# EasyEDA schematic Jafar Tester-Programmer - EasyEDA - Schematic Export.json
TITLE: Jafar Chip - Programmer/Tester; REV: 5.0; Date: 10-05-2024; Sheet: 1/1; Drawn By: Tony Kuberka; Company: TK's Custom Super Modz LLC
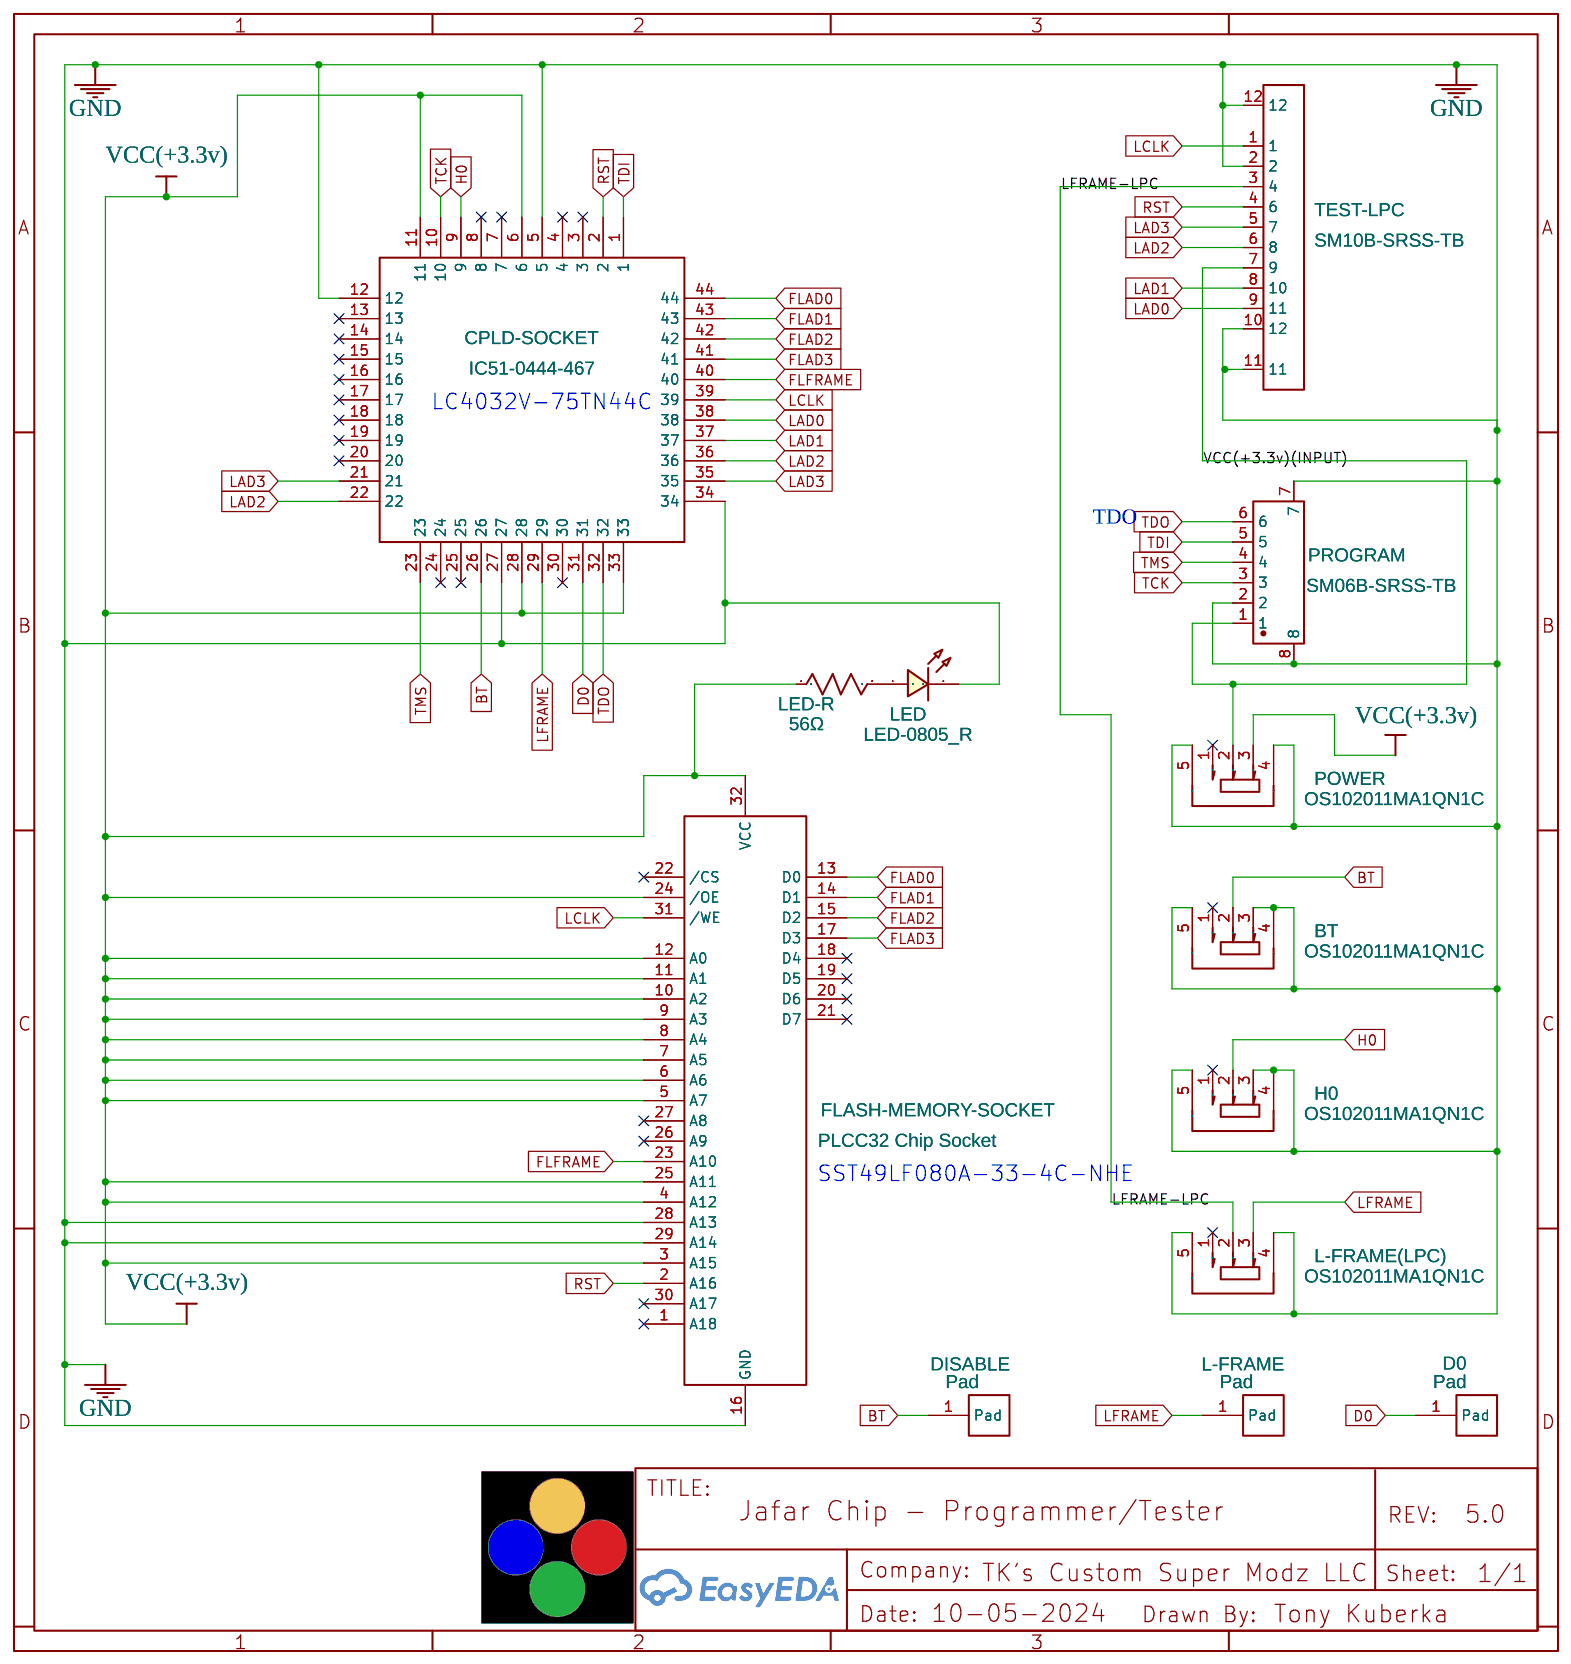
[diagram p0: schematic sheet]

## Parts
BT  OS102011MA1QN1C  [SW-TH_OS102011MA1QN1C]
CPLD-SOCKET  IC51-0444-467  [IC51-0444-467]
D0  Pad  [PADPAD]
DISABLE  Pad  [PADPAD]
FLASH-MEMORY-SOCKET  PLCC32 Chip Socket  [PLCC32MS]
H0  OS102011MA1QN1C  [SW-TH_OS102011MA1QN1C]
L-FRAME  Pad  [PADPAD]
L-FRAME(LPC)  OS102011MA1QN1C  [SW-TH_OS102011MA1QN1C]
LED  LED-0805_R  [LED0805_RED]
LED-R  56Ω  [R0805]
POWER  OS102011MA1QN1C  [SW-TH_OS102011MA1QN1C]
PROGRAM  SM06B-SRSS-TB  [CONN-SMD_SM06B-SRSS-TBLFSN]
TEST-LPC  SM10B-SRSS-TB  [CONN-SMD_10P-P1.00_SM10B-SRSS-TB-LF-SN]

## Library data of the parts
BT H0 L-FRAME(LPC) POWER = OS102011MA1QN1C: Supplier: LCSC; Supplier Part: C221828; Manufacturer: C&K; Contributor: LCSC; JLCPCB Part Class: Extended Part
CPLD-SOCKET = IC51-0444-467 32U4: Contributor: darmayuda.b.ariston
D0 DISABLE L-FRAME = SOLDER PAD: Contributor: Tellon
FLASH-MEMORY-SOCKET = SST39VF040-70-4C-NHE: Manufacturer: Microchip Technology; Supplier: Mouser; Supplier Part: 804-39VF0407CNHE; Contributor: KyleCardoza
LED = LED-0805_R: Manufacturer: EVERLIGHT(台湾亿光); Manufacturer Part: 17-21SURC/S530-A3/TR8; Supplier Part: C72037; Contributor: LCEDA_Lib
LED-R = R_0805_US: Contributor: LCEDA_Lib
PROGRAM = SM06B-SRSS-TB: Supplier: LCSC; Supplier Part: C7588156; Manufacturer: JST; JLCPCB Part Class: Extended Part; Contributor: lcsc
TEST-LPC = SM10B-SRSS-TB (LF)(SN): Contributor: LCSC; Supplier: LCSC; Supplier Part: C160409; Manufacturer: JST; Manufacturer Part: SM10B-SRSS-TB(LF)(SN); JLCPCB Part Class: Extended Part

## Nets
GND: BT.3 BT.4 BT.5 CPLD-SOCKET.5 CPLD-SOCKET.12 CPLD-SOCKET.27 CPLD-SOCKET.34 FLASH-MEMORY-SOCKET.16(GND) FLASH-MEMORY-SOCKET.28(A13) FLASH-MEMORY-SOCKET.29(A14) H0.3 H0.4 H0.5 L-FRAME(LPC).4 L-FRAME(LPC).5 LED.2 POWER.4 POWER.5 PROGRAM.2 PROGRAM.7 PROGRAM.8 TEST-LPC.2 TEST-LPC.10(12) TEST-LPC.11 TEST-LPC.12
VCC(+3.3v): CPLD-SOCKET.6 CPLD-SOCKET.11 CPLD-SOCKET.28 CPLD-SOCKET.33 FLASH-MEMORY-SOCKET.3(A15) FLASH-MEMORY-SOCKET.4(A12) FLASH-MEMORY-SOCKET.5(A7) FLASH-MEMORY-SOCKET.6(A6) FLASH-MEMORY-SOCKET.7(A5) FLASH-MEMORY-SOCKET.8(A4) FLASH-MEMORY-SOCKET.9(A3) FLASH-MEMORY-SOCKET.10(A2) FLASH-MEMORY-SOCKET.11(A1) FLASH-MEMORY-SOCKET.12(A0) FLASH-MEMORY-SOCKET.24(/OE) FLASH-MEMORY-SOCKET.25(A11) FLASH-MEMORY-SOCKET.32(VCC) LED-R.1 POWER.3
VCC(+3.3v)(INPUT): POWER.2 PROGRAM.1 TEST-LPC.7(9)
BT: BT.2 CPLD-SOCKET.26 DISABLE.1(Pad)
D0: CPLD-SOCKET.31 D0.1(Pad)
FLAD0: CPLD-SOCKET.44 FLASH-MEMORY-SOCKET.13(D0)
FLAD1: CPLD-SOCKET.43 FLASH-MEMORY-SOCKET.14(D1)
FLAD2: CPLD-SOCKET.42 FLASH-MEMORY-SOCKET.15(D2)
FLAD3: CPLD-SOCKET.41 FLASH-MEMORY-SOCKET.17(D3)
FLFRAME: CPLD-SOCKET.40 FLASH-MEMORY-SOCKET.23(A10)
H0: CPLD-SOCKET.9 H0.2
LAD0: CPLD-SOCKET.38 TEST-LPC.9(11)
LAD1: CPLD-SOCKET.37 TEST-LPC.8(10)
LAD2: CPLD-SOCKET.22 CPLD-SOCKET.36 TEST-LPC.6(8)
LAD3: CPLD-SOCKET.21 CPLD-SOCKET.35 TEST-LPC.5(7)
LCLK: CPLD-SOCKET.39 FLASH-MEMORY-SOCKET.31(/WE) TEST-LPC.1
LFRAME: CPLD-SOCKET.29 L-FRAME.1(Pad) L-FRAME(LPC).3
LFRAME-LPC: L-FRAME(LPC).2 TEST-LPC.3(4)
RST: CPLD-SOCKET.2 FLASH-MEMORY-SOCKET.2(A16) TEST-LPC.4(6)
TCK: CPLD-SOCKET.10 PROGRAM.3
TDI: CPLD-SOCKET.1 PROGRAM.5
TDO: CPLD-SOCKET.32 PROGRAM.6
TMS: CPLD-SOCKET.23 PROGRAM.4
Net-(LED-1): LED.1 LED-R.2

Not connected (* = marked no-connect by the designer): BT 1*; CPLD-SOCKET 3* 4* 7* 8* 13* 14* 15* 16* 17* 18* 19* 20* 24* 25* 30*; FLASH-MEMORY-SOCKET 1(A18)* 18(D4)* 19(D5)* 20(D6)* 21(D7)* 22(/CS)* 26(A9)* 27(A8)* 30(A17)*; H0 1*; L-FRAME(LPC) 1*; POWER 1*

## Notes on the sheet
- LC4032V-75TN44C
- TDO
- SST49LF080A-33-4C-NHE
